# Altium project HAB_RADIO_BOARD.PrjPcb
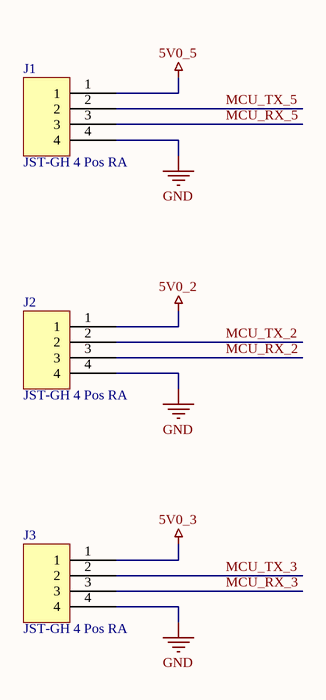
[diagram p0: [04] CONNECTORS.SchDoc]
2 sheets, 5 parts. Net scope: global (net labels, ports and power ports of the same name join across sheets).
Board file: HAB_RADIO_BOARD.PcbDoc
Sheets:
  [04] CONNECTORS.SchDoc
  [05] RADIOS.SchDoc

## Sheet [04] CONNECTORS.SchDoc
size A

### Parts
J1  JST-GH 4 Pos RA  [SM04B-GHS-TB(LF)(SN)-]
J2  JST-GH 4 Pos RA  [SM04B-GHS-TB(LF)(SN)-]
J3  JST-GH 4 Pos RA  [SM04B-GHS-TB(LF)(SN)-]

### Nets
5V0_2: J2.1
5V0_3: J3.1
5V0_5: J1.1
GND: J1.4 J2.4 J3.4
MCU_RX_2: J2.3
MCU_RX_3: J3.3
MCU_RX_5: J1.3
MCU_TX_2: J2.2
MCU_TX_3: J3.2
MCU_TX_5: J1.2

### Library data of the parts
J1-J3 = SM04B-GHS-TB(LF)(SN)-: JST-GH CONN HEADER SMD R/A 4 POS 1.25MM; Manufacturer: JST; Connector Type: Outer Shroud Contact; Number of Positions: 4; Pitch: 0.049inch; Supplier 1: Digi-Key; Manufacturer Part Number: SM04B-GHS-TB(LF)(SN)-; RoHS: Yes; Category: Connectors; Stock 1: 34258; Pricing 1: 1=0.45000, 10=0.42300, 100=0.32440, 500=0.28212, 1000=0.23274 (USD); Mount: Surface Mount; Color: Natural; Contact Plating: Tin; Number of Rows: 1; Fastening Type: Ramp; Packaging: Cut Tape; Termination: Solder; ComponentLink1URL: https://datasheet.ciiva.com/6832/egh-6832463.pdf?src-supplier=Digi-Key; ComponentLink1Description: https://datasheet.ciiva.com/6832/egh-6832463.pdf?src-supplier=Digi-Key; Supplier Part Number 1: 455-1566-1-ND

## Sheet [05] RADIOS.SchDoc
size A
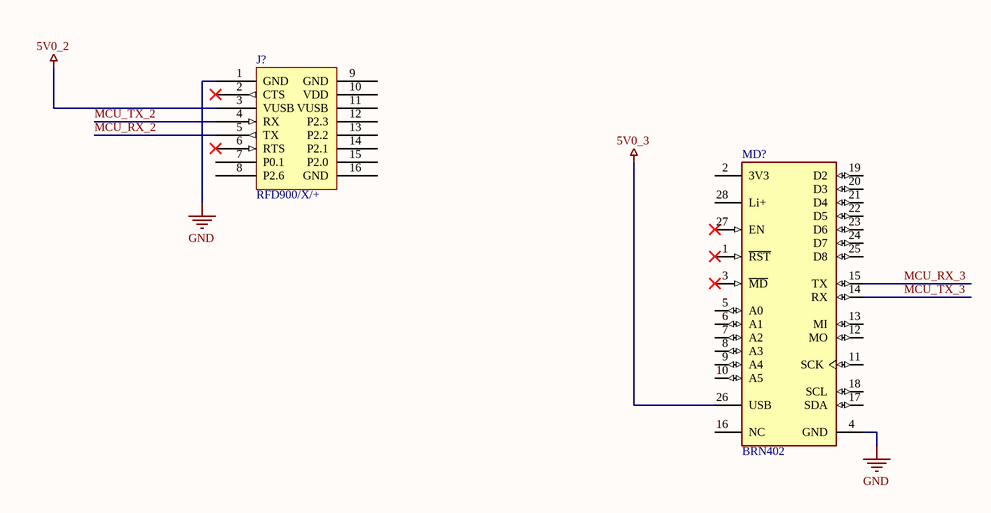
[diagram p1: [05] RADIOS.SchDoc]

### Parts
J?  RFD900/X/+  [RFD900]
MD?  BRN402  [FP-BRN402-0]

### Nets
5V0_2: J?.3(VUSB)
5V0_3: MD?.26(USB)
GND: J?.1(GND) MD?.4(GND)
MCU_RX_2: J?.5(TX)
MCU_RX_3: MD?.15(TX)
MCU_TX_2: J?.4(RX)
MCU_TX_3: MD?.14(RX)

Not connected (* = marked no-connect by the designer): J? 2(CTS)* 6(RTS)* 7(P0.1) 8(P2.6) 9(GND) 10(VDD) 11(VUSB) 12(P2.3) 13(P2.2) 14(P2.1) 15(P2.0) 16(GND); MD? 1(~{RST})* 2(3V3) 3(~{MD})* 5(A0) 6(A1) 7(A2) 8(A3) 9(A4) 10(A5) 11(SCK) 12(MO) 13(MI) 16(NC) 17(SDA) 18(SCL) 19(D2) 20(D3) 21(D4) 22(D5) 23(D6) 24(D7) 25(D8) 27(EN)* 28(Li+)

### Library data of the parts
J? = RFD900: 900MHz Data Modem
MD? = CMP-201502-000001-1: BORON LTE; Manufacturer: Particle; Number Of Adc Channels: 6; Data Rate: 2000kbits/s; Max Frequency: 3000MHz; Min Supply Voltage: 3V; Interface: I2C,SPI,UART,USB; Description: Boron LTE CAT-M1 enabled development kit; Max Supply Voltage: 4.4V; Bandwidth: 2302MHz; Nominal Supply Current: 70-100000uA; Number Of Gpio: 20; Category: UNK; Temperature Range Low: -20°C; Temperature: -20°C to +60°C; Package: BRN402; Automotive: No; Device Class L2: RF Semiconductors and Devices; ComponentLink2Description: Datasheet; Manufacturer Part Number: BRN402; ComponentLink2URL: https://docs.particle.io/assets/pdfs/datasheets/boron-datasheet.pdf; Lead Free: Yes; Device Class L3: Transceivers; RoHS: TRUE; Octopart: https://octopart.com/brn402-particle-96116406; Device Class L1: Integrated Circuits (ICs); Digikey Description: BORON LTE; Temperature Range High: +60°C

## Nets that join several sheets
5V0_2: [04] CONNECTORS (J2.1), [05] RADIOS (J?.3)
5V0_3: [04] CONNECTORS (J3.1), [05] RADIOS (MD?.26)
GND: [04] CONNECTORS (J1.4 J2.4 J3.4), [05] RADIOS (J?.1 MD?.4)
MCU_RX_2: [04] CONNECTORS (J2.3), [05] RADIOS (J?.5)
MCU_RX_3: [04] CONNECTORS (J3.3), [05] RADIOS (MD?.15)
MCU_TX_2: [04] CONNECTORS (J2.2), [05] RADIOS (J?.4)
MCU_TX_3: [04] CONNECTORS (J3.2), [05] RADIOS (MD?.14)